# Altium schematic sheet input.SchDoc
size A4
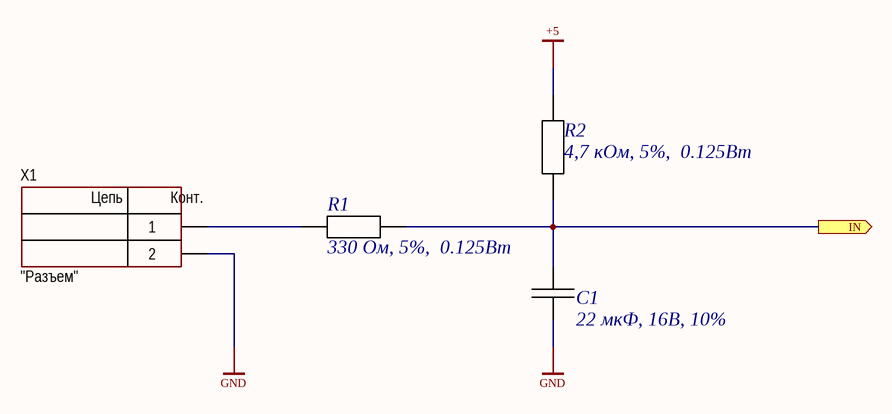
[diagram p0: input.SchDoc]

## Parts
C1  22 мкФ, 16В, 10%  [CAP: 1206]
R1  330 Ом, 5%,  0.125Вт  [RES: 0805]
R2  4,7 кОм, 5%,  0.125Вт  [RES: 0805]
X1  CommentText: "Разъем"  [TB_2_2.5MM]

## Ports
IN (out)

## Nets
+5: R2.2
GND: C1.1 X1.2
IN: C1.2 R1.2 R2.1 ; port IN
NetR1_1: R1.1 X1.1

## Notes on the sheet
- (in symbol DG308-2.54-02P-14-00A(H)) Цепь; Конт.

## Library data of the parts
C1 = GRM31CR61C226KE15L: Конденсатор; Manufacturer: Murata Manufacturing; ValueOther: Value; ID: 29; ChipDip: #https://www.chipdip.ru/product/grm31cr61c226ke15l#; ElementName: Кер.ЧИП конд. 22 мкФ X5R 10% 16В 1206, GRM31CR61C226KE15L*; ValueSCH: 22 мкФ, 16В, 10%; Partnumber: GRM31CR61C226KE15L; price: 26*10; last_update: 15.04.2021
R1 = RC0805JR-07330RL: Бескорпусные толстопленочные резисторы; Manufacturer: Тайвань; Value: 100; Power: 0,25; ID: 41; ElementName: Чип резистор (SMD), 330 Ом, 5%, 0.125Вт 0805; ChipDip: #https://www.chipdip.ru/product/0.125w-0805-330-om-5#; MaxVoltage: 150 В; ValueSCH: 330 Ом, 5%,  0.125Вт; Partnumber: RC0805JR-07330RL; Package: 0805; Price: 6*20; Last_update: 12.10.2023
R2 = RC0805JR-074K7L: Бескорпусные толстопленочные резисторы; Manufacturer: Тайвань; Value: 100; Power: 0,25; ID: 42; ElementName: Чип резистор (SMD), 4.7 кОм, 5%, 0.125Вт 0805; ChipDip: #https://www.chipdip.ru/product/0.125w-0805-4.7-kom-5#; MaxVoltage: 150 В; ValueSCH: 4,7 кОм, 5%,  0.125Вт; Partnumber: RC0805JR-074K7L; Package: 0805; Price: 6*20; Last_update: 12.10.2023
X1 = DG308-2.54-02P-14-00A(H): Винтовой клеммный блок c рельефной обоймой, 2 контакта. Серия DG308-2.54; Manufacturer: Китай; ValueManufacturerPartNumber: Terminal connector, 2pin, 3.5mm, 300VAC, 10A; TypeConnector: Terminal connector; VoltageMax: 300VAC; Pitch: 3.5mm; CurrentMax: 10A; Multichannel: 2pin; ID: 6; ElementName: 308-021-14, Клеммник винтовой, 2-контактный, 2.54мм, прямой; ValueSCH: Клемник 308-021-14; ChipDip: #https://www.chipdip.ru/product/308-021-12-14#; HelpURL: https://www.chipdip.ru/product/dg350-3.5-02p-12; PartNumber: DG308-2.54-02P-14-00A(H); Price: 19 ₽; Last_update: 23.11.2020